# Altium schematic sheet PAGE5 - BANK1 I_O.SchDoc
size 386 x 246 mm
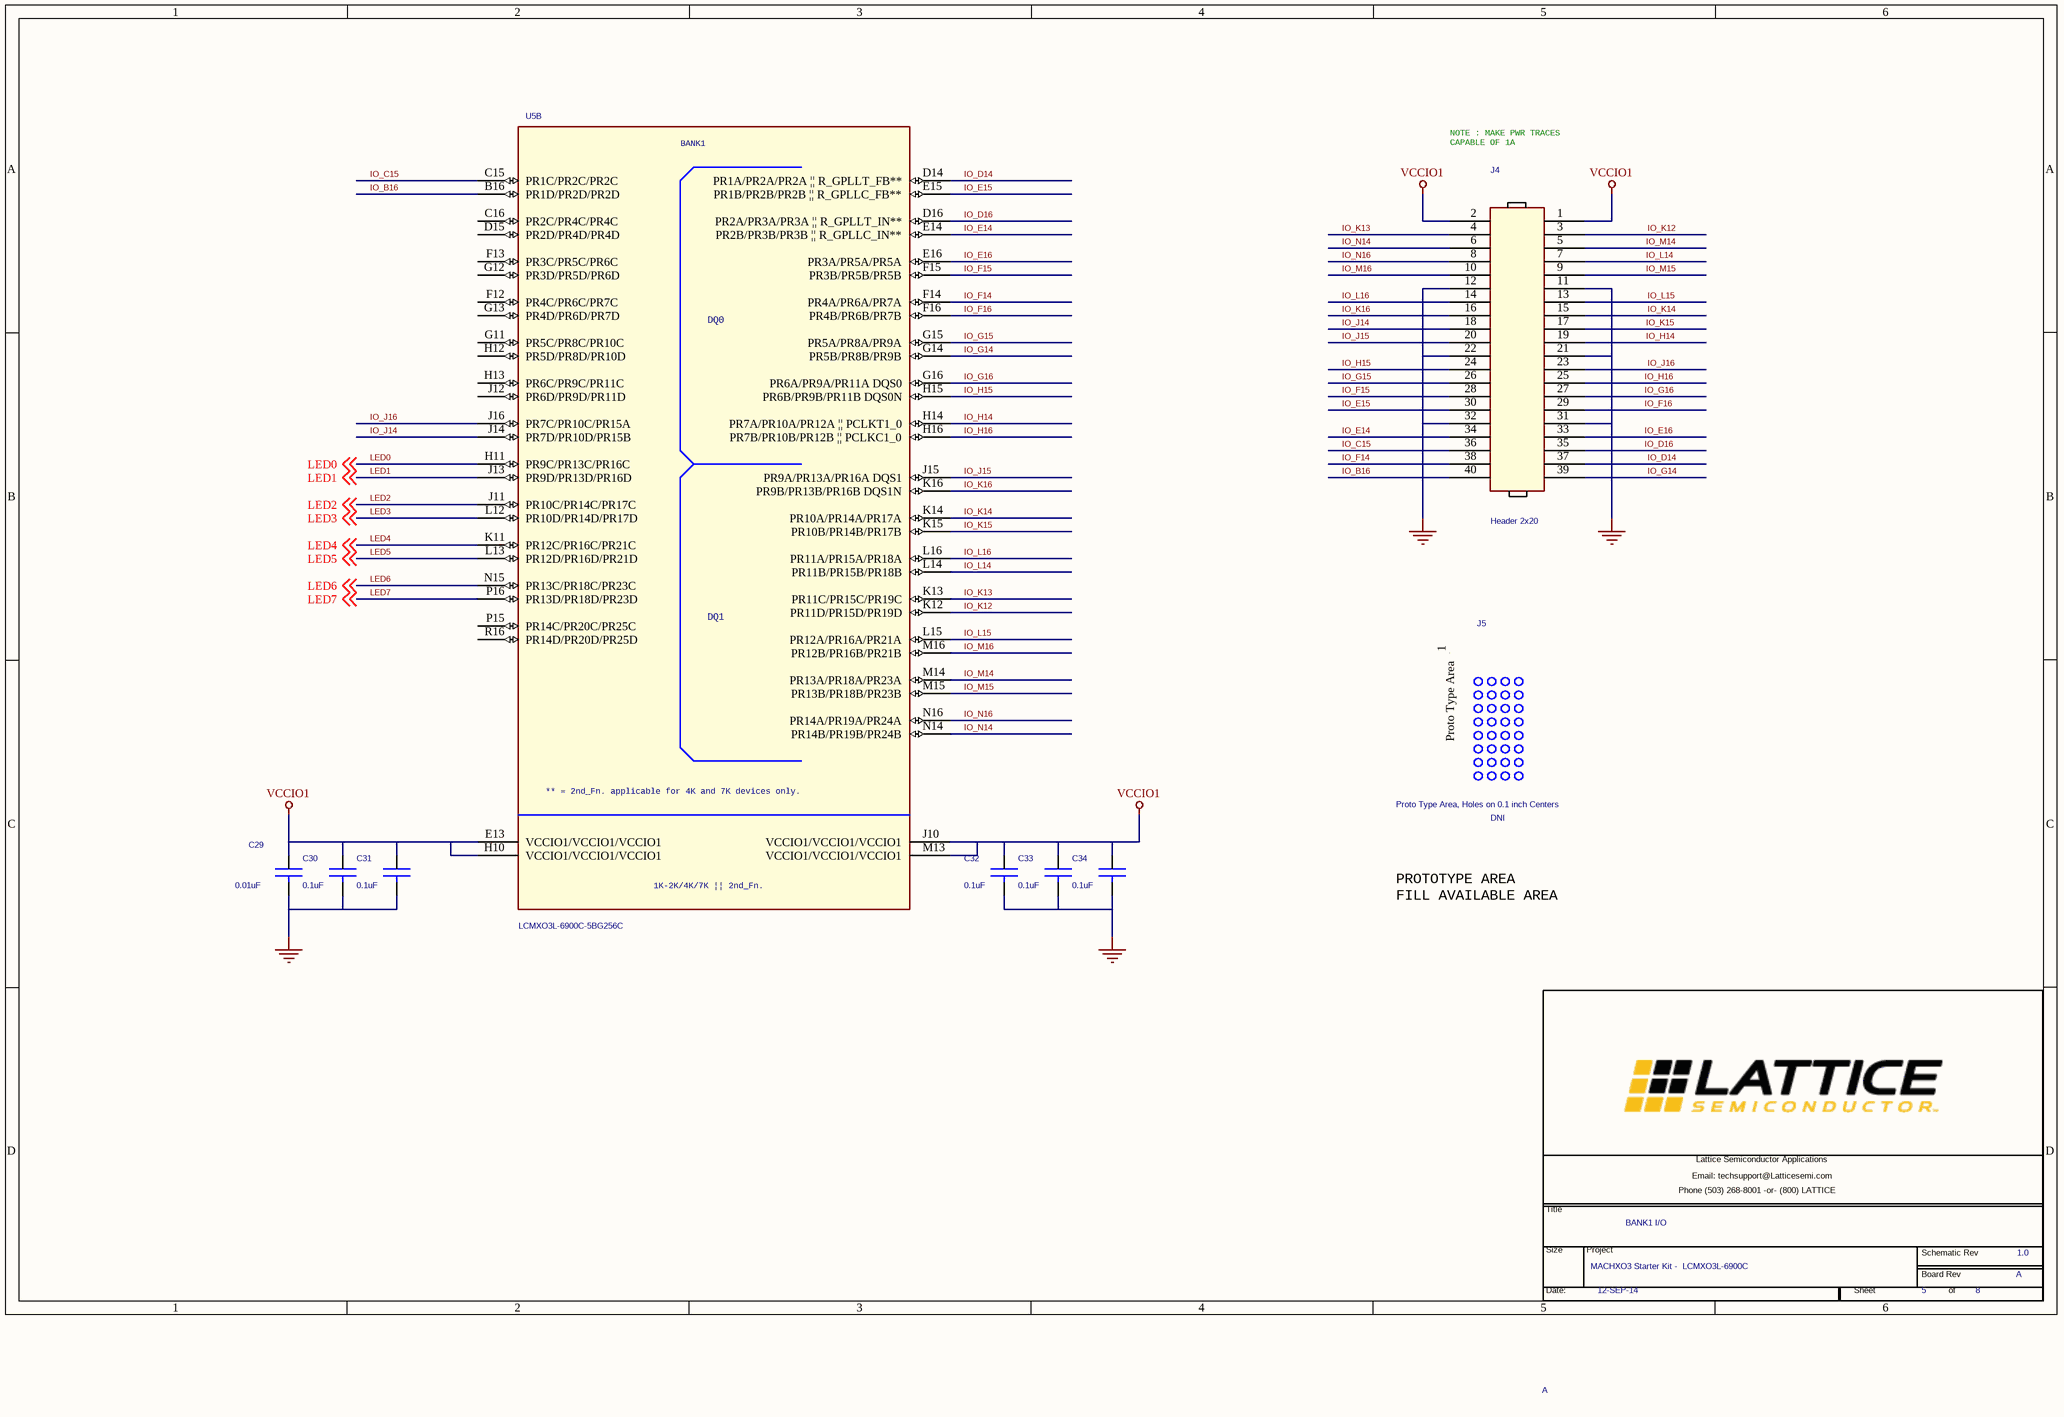
[diagram p0: PAGE5 - BANK1 I_O.SchDoc]

## Parts
*  Project Name: MACHXO3 Starter Kit -  LCMXO3L-6900C  Title: BANK1 I/O  Page Number: 5  Page Count: 8  RevCode: 1.0  Page Size: A  Date:: 12-SEP-14  (hidden comment: Lattice Title Block New Brand)  (graphical)
C29  0.01uF  [cc0402]
C30  0.1uF  [cc0402]
C31  0.1uF  [cc0402]
C32  0.1uF  [cc0402]
C33  0.1uF  [cc0402]
C34  0.1uF  [cc0402]
J4  Header 2x20  [hdr_samtec_mtsw_2x20_100]
J5  Proto Type Area, Holes on 0.1 inch Centers  ASSY: DNI  [hdr_th_4x10_100]
U5  LCMXO3L-6900C-5BG256C  [bga256_0p8_14p0]  (part B of 7)

## Nets
GND: C29.2 C30.2 C31.2 C32.2 C33.2 C34.2 J4.11 J4.12 J4.21 J4.22 J4.31 J4.32
VCCIO1: C29.1 C30.1 C31.1 C32.1 C33.1 C34.1 J4.1 J4.2 U5.E13(VCCIO1/VCCIO1/VCCIO1) U5.H10(VCCIO1/VCCIO1/VCCIO1) U5.J10(VCCIO1/VCCIO1/VCCIO1) U5.M13(VCCIO1/VCCIO1/VCCIO1)
IO_B16: J4.40 U5.B16(PR1D/PR2D/PR2D)
IO_C15: J4.36 U5.C15(PR1C/PR2C/PR2C)
IO_D14: J4.37 U5.D14(PR1A/PR2A/PR2A_||_R_GPLLT_FB**)
IO_D16: J4.35 U5.D16(PR2A/PR3A/PR3A_||_R_GPLLT_IN**)
IO_E14: J4.34 U5.E14(PR2B/PR3B/PR3B_||_R_GPLLC_IN**)
IO_E15: J4.30 U5.E15(PR1B/PR2B/PR2B_||_R_GPLLC_FB**)
IO_E16: J4.33 U5.E16(PR3A/PR5A/PR5A)
IO_F14: J4.38 U5.F14(PR4A/PR6A/PR7A)
IO_F15: J4.28 U5.F15(PR3B/PR5B/PR5B)
IO_F16: J4.29 U5.F16(PR4B/PR6B/PR7B)
IO_G14: J4.39 U5.G14(PR5B/PR8B/PR9B)
IO_G15: J4.26 U5.G15(PR5A/PR8A/PR9A)
IO_G16: J4.27 U5.G16(PR6A/PR9A/PR11A_DQS0)
IO_H14: J4.19 U5.H14(PR7A/PR10A/PR12A_||_PCLKT1_0)
IO_H15: J4.24 U5.H15(PR6B/PR9B/PR11B_DQS0N)
IO_H16: J4.25 U5.H16(PR7B/PR10B/PR12B_||_PCLKC1_0)
IO_J14: J4.18 U5.J14(PR7D/PR10D/PR15B)
IO_J15: J4.20 U5.J15(PR9A/PR13A/PR16A_DQS1)
IO_J16: J4.23 U5.J16(PR7C/PR10C/PR15A)
IO_K12: J4.3 U5.K12(PR11D/PR15D/PR19D)
IO_K13: J4.4 U5.K13(PR11C/PR15C/PR19C)
IO_K14: J4.15 U5.K14(PR10A/PR14A/PR17A)
IO_K15: J4.17 U5.K15(PR10B/PR14B/PR17B)
IO_K16: J4.16 U5.K16(PR9B/PR13B/PR16B_DQS1N)
IO_L14: J4.7 U5.L14(PR11B/PR15B/PR18B)
IO_L15: J4.13 U5.L15(PR12A/PR16A/PR21A)
IO_L16: J4.14 U5.L16(PR11A/PR15A/PR18A)
IO_M14: J4.5 U5.M14(PR13A/PR18A/PR23A)
IO_M15: J4.9 U5.M15(PR13B/PR18B/PR23B)
IO_M16: J4.10 U5.M16(PR12B/PR16B/PR21B)
IO_N14: J4.6 U5.N14(PR14B/PR19B/PR24B)
IO_N16: J4.8 U5.N16(PR14A/PR19A/PR24A)
LED0: U5.H11(PR9C/PR13C/PR16C) ; off-sheet LED0
LED1: U5.J13(PR9D/PR13D/PR16D) ; off-sheet LED1
LED2: U5.J11(PR10C/PR14C/PR17C) ; off-sheet LED2
LED3: U5.L12(PR10D/PR14D/PR17D) ; off-sheet LED3
LED4: U5.K11(PR12C/PR16C/PR21C) ; off-sheet LED4
LED5: U5.L13(PR12D/PR16D/PR21D) ; off-sheet LED5
LED6: U5.N15(PR13C/PR18C/PR23C) ; off-sheet LED6
LED7: U5.P16(PR13D/PR18D/PR23D) ; off-sheet LED7

Not connected (* = marked no-connect by the designer): J5 1(Proto_Type_Area); U5 C16(PR2C/PR4C/PR4C) D15(PR2D/PR4D/PR4D) F12(PR4C/PR6C/PR7C) F13(PR3C/PR5C/PR6C) G11(PR5C/PR8C/PR10C) G12(PR3D/PR5D/PR6D) G13(PR4D/PR6D/PR7D) H12(PR5D/PR8D/PR10D) H13(PR6C/PR9C/PR11C) J12(PR6D/PR9D/PR11D) P15(PR14C/PR20C/PR25C) R16(PR14D/PR20D/PR25D)

## Notes on the sheet
- NOTE : MAKE PWR TRACES
  CAPABLE OF 1A
- PROTOTYPE AREA
  FILL AVAILABLE AREA
- (in symbol Lattice Title Block New Brand) Lattice Semiconductor Applications; Email: techsupport@Latticesemi.com; Phone (503) 268-8001 -or- (800) LATTICE; Title; Size; Project; Schematic Rev; Board Rev; Date:; Sheet; of
- (in symbol LCMXO3L-1K/2K/4K/7K-BG256, part B) BANK1; DQ0; DQ1; ** = 2nd_Fn. applicable for 4K and 7K devices only.; 1K-2K/4K/7K || 2nd_Fn.

## Library data of the parts
C29 = 0_01uF_0402: CAP CER 10000PF 16V 5% X7R 0402; Manufacturer Part Number: C0402C103J4RACTU; Manufacturer: Kemet; Class: Discrete; Digikey P/N: 399-1039-1-ND
C30-C34 = 0u1_0402: CAP CER 0.1UF 16V 10% X7R 0402; Manufacturer Part Number: C0402C104K4RACTU; Manufacturer: Kemet; Class: Discrete; Digikey P/N: 399-3521-2-ND
J4 = HEADER 20X2: CONN HEADER 40POS .100" DL GOLD; Manufacturer Part Number: TSW-120-07-G-D; Manufacturer: Samtec; ASSY: DNI; Digikey P/N: SAM1028-20-ND
J5 = Proto Area
U5 = LCMXO3L-1K/2K/4K/7K-BG256: IC FPGA 6864LUTS 256BGA; Manufacturer: Lattice semi; SPLIT_INST: TRUE; SWAP_INFO: (S1+S2+S3+S4+S5+S6+S7); Graphic: LCMXO3L-1K/2K/4K/7K-BG256A.Normal; Power Pins Visible: False; Source Library: D:\DESIGN_DOC\XO3\LATTICEORCADCAPTURESCHEMATICLIBRARYOLB\LATTICEORCADCAPTURESCHEMATICLIBRARYOLB\LATTICE_SYM\LATTICEPLDS.OLB; Location Y-Coordinate: 0; Implementation Type: <none>; Primitive: DEFAULT; Name: I16790692; Digikey P/N: 220-1886-ND; Source Package: LCMXO3L-1K/2K/4K/7K-BG256; Source Part: LCMXO3L-1K/2K/4K/7K-BG256A.Normal; Color: Default; Location X-Coordinate: 0; Manufacturer Part Number: LCMXO3L-6900C-5BG256C
* = Lattice Title Block New Brand: Board Rev: A